# EAGLE design BuzzerBaseShieldv00 (EAGLE 6.6.0)
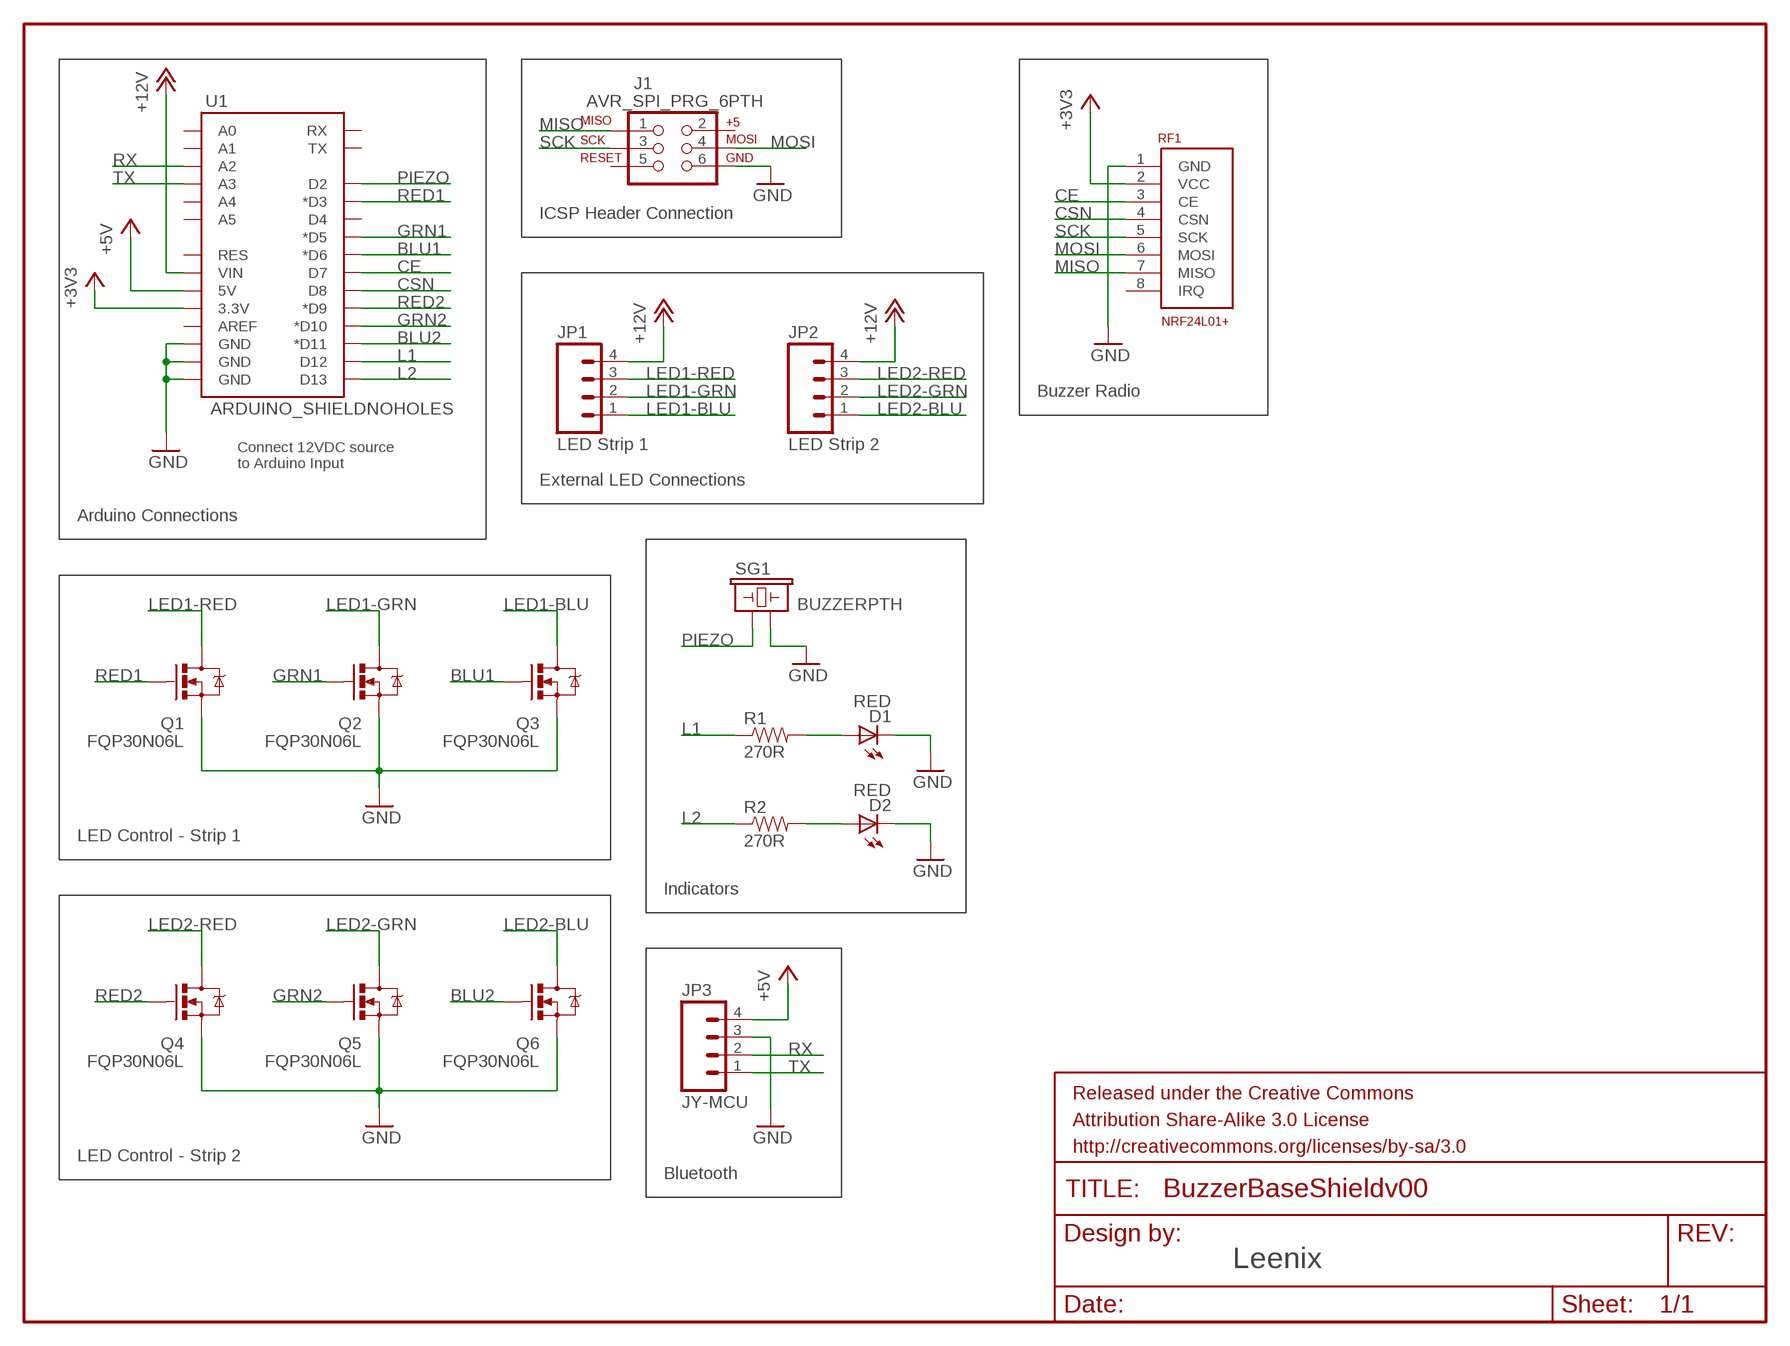
[diagram p0: schematic, sheet 1, part 1 of 2]
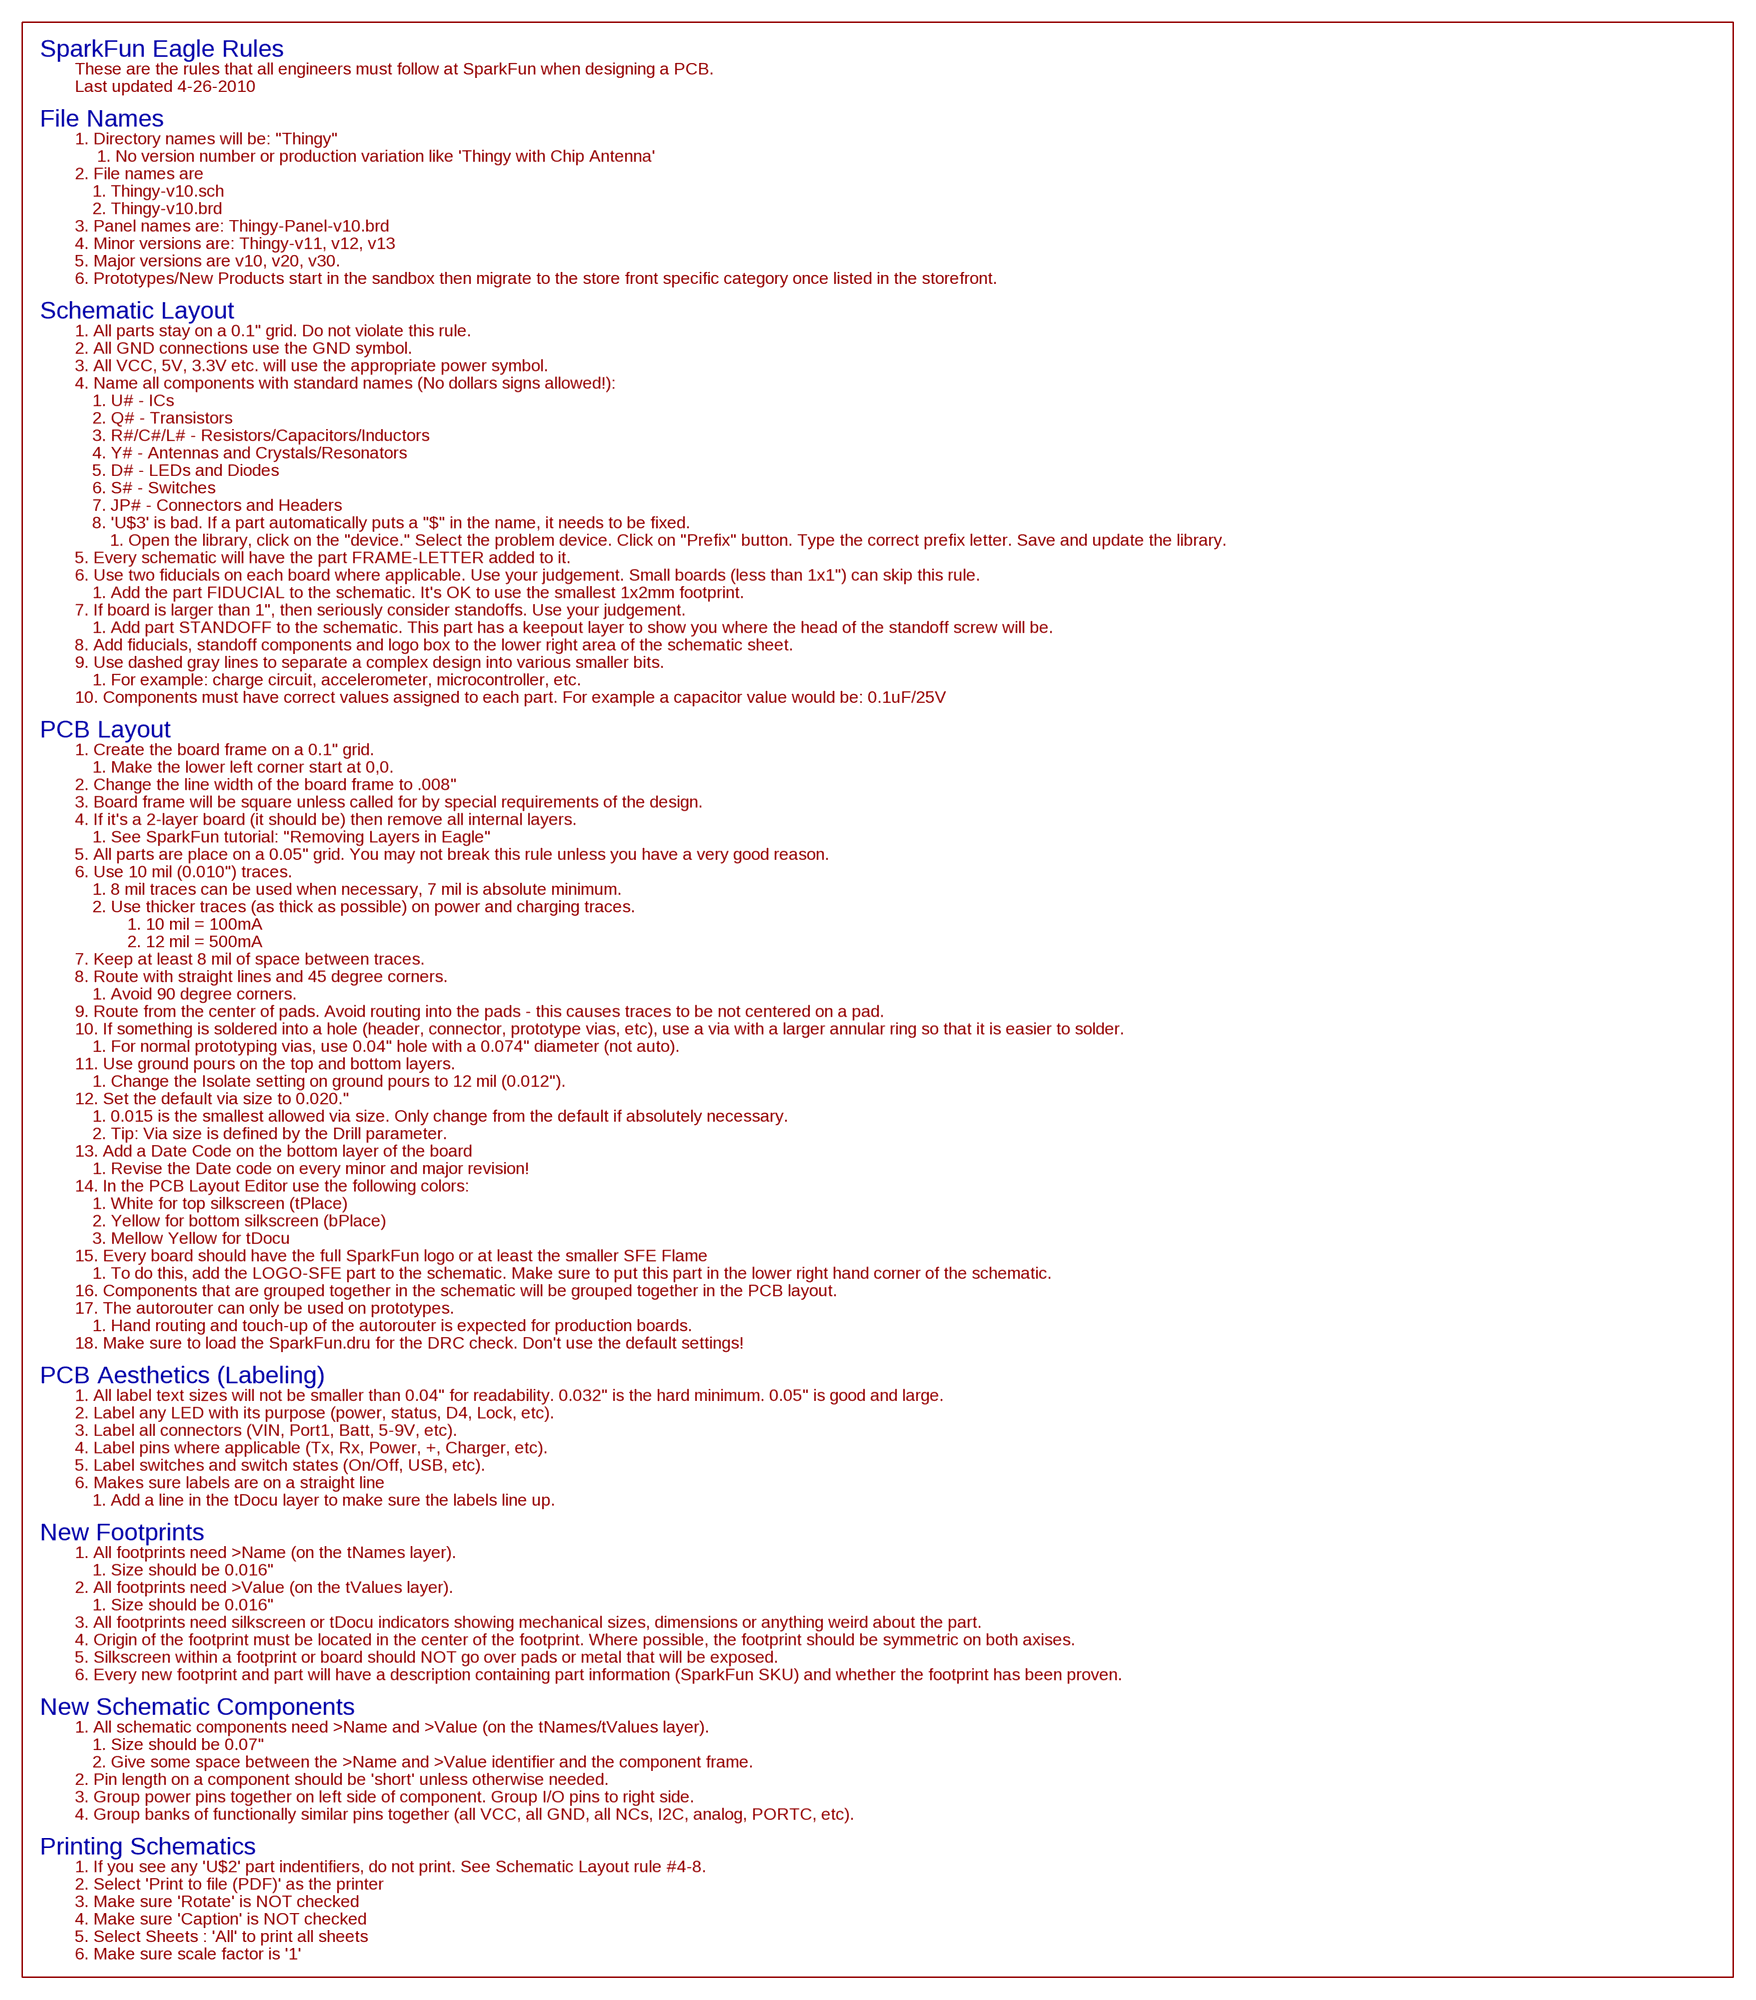
[diagram p1: schematic, sheet 1, part 2 of 2]

## Parts
D1  RED  LED-RED1206  [LED-1206]
D2  RED  LED-RED1206  [LED-1206]
FRAME1  FRAME-LETTER  [CREATIVE_COMMONS]
J1  AVR_SPI_PRG_6PTH  [2X3]
JP1  LED Strip 1  M04LONGPADS  [1X04_LONGPADS]
JP2  LED Strip 2  M04LONGPADS  [1X04_LONGPADS]
JP3  JY-MCU  M04PTH  [1X04]
Q1  FQP30N06L  MOSFET-NCHANNELFQP30N06L  [TO220V]
Q2  FQP30N06L  MOSFET-NCHANNELFQP30N06L  [TO220V]
Q3  FQP30N06L  MOSFET-NCHANNELFQP30N06L  [TO220V]
Q4  FQP30N06L  MOSFET-NCHANNELFQP30N06L  [TO220V]
Q5  FQP30N06L  MOSFET-NCHANNELFQP30N06L  [TO220V]
Q6  FQP30N06L  MOSFET-NCHANNELFQP30N06L  [TO220V]
R1  270R  RESISTOR1206  [1206]
R2  270R  RESISTOR1206  [1206]
RF1  NRF24L01+  [NRF24L01+-HEADER]
SG1  BUZZERPTH  [BUZZER-12MM]
U1  ARDUINO_SHIELDNOHOLES  [DUEMILANOVE_SHIELD_NOHOLES]

## Nets
+3V3: RF1.2(VCC) U1.3.3V
+5V: JP3.4 U1.5V
+12V: JP1.4 JP2.4 U1.VIN
BLU1: Q3.1(G) U1.D6(*D6)
BLU2: Q6.1(G) U1.D11(*D11)
CE: RF1.3(CE) U1.D7
CSN: RF1.4(CSN) U1.D8
GND: D1.C D2.C J1.6 JP3.3 Q1.3(S) Q2.3(S) Q3.3(S) Q4.3(S) Q5.3(S) Q6.3(S) RF1.1(GND) SG1.- U1.GND@0(GND) U1.GND@1(GND) U1.GND@2(GND)
GRN1: Q2.1(G) U1.D5(*D5)
GRN2: Q5.1(G) U1.D10(*D10)
L1: R1.1 U1.D12
L2: R2.1 U1.D13
LED1-BLU: JP1.1 Q3.2(D)
LED1-GRN: JP1.2 Q2.2(D)
LED1-RED: JP1.3 Q1.2(D)
LED2-BLU: JP2.1 Q6.2(D)
LED2-GRN: JP2.2 Q5.2(D)
LED2-RED: JP2.3 Q4.2(D)
MISO: J1.1 RF1.7(MISO)
MOSI: J1.4 RF1.6(MOSI)
N$1: D2.A R2.2
N$2: D1.A R1.2
PIEZO: SG1.+ U1.D2
RED1: Q1.1(G) U1.D3(*D3)
RED2: Q4.1(G) U1.D9(*D9)
RX: JP3.2 U1.A2
SCK: J1.3 RF1.5(SCK)
TX: JP3.1 U1.A3
Unconnected: J1.2 J1.5 RF1.8(IRQ) U1.A0 U1.A1 U1.A4 U1.A5 U1.AREF U1.D4 U1.RES U1.RX U1.TX

## Notes on the sheet
- ICSP Header Connection
- Buzzer Radio
- Connect 12VDC source
  to Arduino Input
- External LED Connections
- Arduino Connections
- LED Control - Strip 1
- Indicators
- LED Control - Strip 2
- Bluetooth
- Leenix

## Library data of the parts
D1 D2 = SparkFun-LED:LED-RED: Assorted Red LEDs LilyPad 1206- DIO-09912 1206- DIO-00809 0603- DIO-00819; PROD_ID: DIO-00809
FRAME1 = SparkFun-Aesthetics:FRAME-LETTER: Schematic Frame Standard 8.5x11 US Letter frame
J1 = SparkFun-Connectors:AVR_SPI_PRG_6: AVR ISP 6 Pin This is the reduced ISP connector for AVR programming. Common on Arduino. This footprint will take up less PCB space and can be used with a 10-pin to 6-pin adapter such as SKU: BOB-08508
JP1-JP3 = SparkFun-Connectors:M04: Header 4 Standard 4-pin 0.1" header. Use with straight break away headers (SKU : PRT-00116), right angle break away headers (PRT-00553), swiss pins (PRT-00743), machine pins (PRT-00117), and female headers (PRT-00115). Molex polarized connector foot print use with SKU : PRT-08231 with associated crimp pins and housings. 1MM SMD Version SKU: PRT-10208
Q1-Q6 = SparkFun-DiscreteSemi:MOSFET-NCHANNEL: Common NMOSFET Parts MFG P/N Store ID Prod ID FDD8780 TRANS-09984 SI7820DN TRANS-11055 FDS6630A IC-08089 2N7002PW TRANS-11151 FQP30N06L COM-10213 TRANS-10060 BSS123LT1G TRANS-08345 BSS138 TRANS-00830 BS170 2N7000; PROD_ID: TRANS-10060
R1 R2 = SparkFun-Resistors:RESISTOR: Resistor Basic schematic elements and footprints for 0603, 1206, and PTH resistors.
RF1 = Leenix:NRF24L01+
SG1 = SparkFun-Electromechanical:BUZZER: Buzzer 12mm Spark Fun Electronics SKU : Comp-Buzzer
U1 = SparkFun-Boards:ARDUINO_SHIELD: Arduino shield footprint

## Board
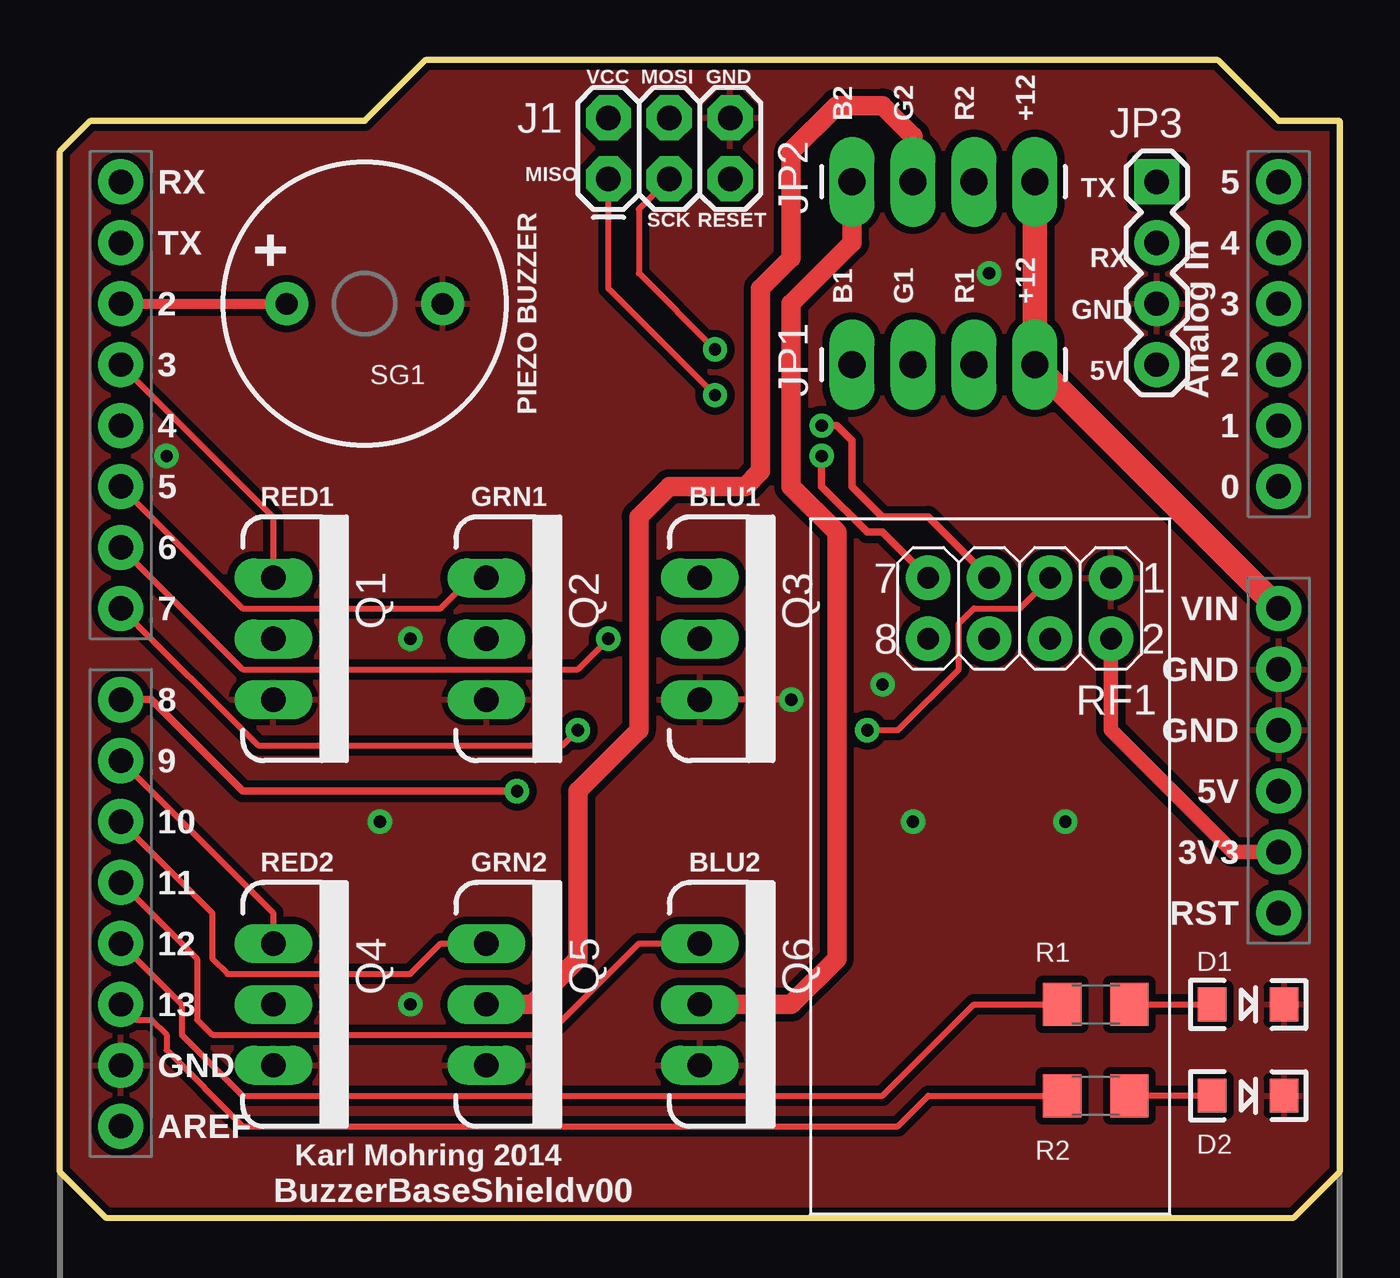
[diagram p2: board, top side]
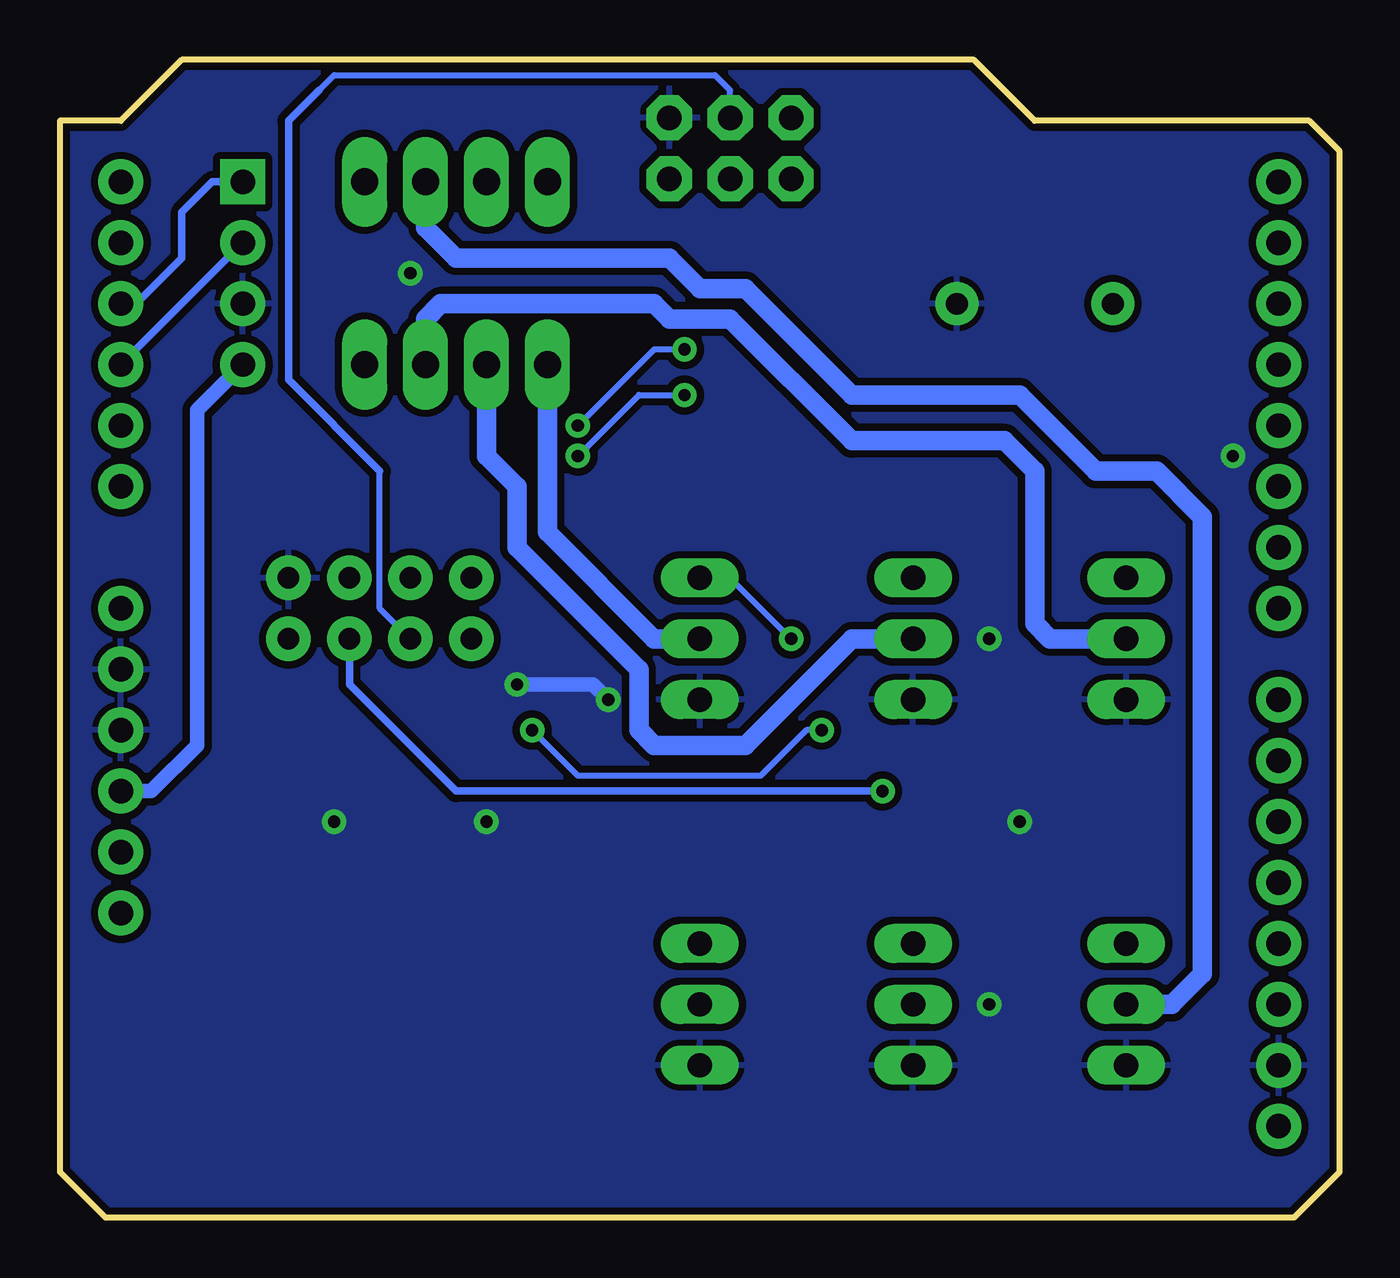
[diagram p3: board, bottom side, seen from below]

Size 53.34 x 48.26 mm. Coordinates in mm from the lower left corner, seen from the top.
Outline: 1.91,0 0,1.91 0,44.45 1.27,45.72 12.7,45.72 15.24,48.26 48.26,48.26 50.8,45.72 53.34,45.72 53.34,1.91 51.44,0 1.91,0
Copper layers (1*16): Top 0.035mm / dielectric 1.5mm / Bottom 0.035mm
Design rules "SparkFun": minimum track width 8mil, minimum drill 20mil, track to track 8mil, track to pad 8mil, pad to pad 8mil, via to via 8mil, smd to smd 8mil, copper to edge 10mil, drill to drill 8mil, minimum pad ring 12mil, minimum via ring 10mil, stop-mask expansion 4mil, vias tented up to drill 25mil, thermal gap 10mil

### Footprints (pad centres in the part's own frame; a part is rotated, then mirrored left to right if it is on the bottom)
LED-1206 = smd 1.2 x 1.4: A -1.5,0; C 1.5,0
2X3 = drill 1.016 pad 1.88 octagon: 1 0,0; 2 0,2.54; 3 2.54,0; 4 2.54,2.54; 5 5.08,0; 6 5.08,2.54
1X04_LONGPADS = drill 1.118 pad 1.88 long: 1 0,0; 2 2.54,0; 3 5.08,0; 4 7.62,0
1X04 = drill 1.016 pad 1.88 square: 1 0,0 | drill 1.016 pad 1.88: 2 2.54,0; 3 5.08,0; 4 7.62,0
TO220V = drill 1.016 long: 1 -2.54,0; 2 0,0; 3 2.54,0
1206 = smd 1.6 x 1.8: 1 -1.4,0; 2 1.4,0
NRF24L01+-HEADER = drill 0.9 pad 1.85: 1 -2.54,-2.54; 2 -2.54,0; 3 0,-2.54; 4 0,0; 5 2.54,-2.54; 6 2.54,0; 7 5.08,-2.54; 8 5.08,0
BUZZER-12MM = drill 0.9 pad 1.778: + 3.25,0; - -3.25,0
DUEMILANOVE_SHIELD_NOHOLES = drill 1.016 pad 1.88: 3.3V 50.8,26.67; 5V 50.8,29.21; A0 50.8,41.91; A1 50.8,44.45; A2 50.8,46.99; A3 50.8,49.53; A4 50.8,52.07; A5 50.8,54.61; AREF 2.54,15.24; D2 2.54,49.53; D3 2.54,46.99; D4 2.54,44.45; D5 2.54,41.91; D6 2.54,39.37; D7 2.54,36.83; D8 2.54,33.02; D9 2.54,30.48; D10 2.54,27.94; D11 2.54,25.4; D12 2.54,22.86; D13 2.54,20.32; GND@0 50.8,31.75; GND@1 50.8,34.29; GND@2 2.54,17.78; RES 50.8,24.13; RX 2.54,54.61; TX 2.54,52.07; VIN 50.8,36.83

### Placement (x,y rotation side)
D1  49.53,8.89 0 top
D2  49.53,5.08 0 top
FRAME1  0,80.01 0 top  (outside the outline)
J1  22.86,43.31 0 top
JP1  33.02,35.56 0 top
JP2  33.02,43.18 0 top
JP3  45.72,43.18 270 top
Q1  8.89,24.13 270 top
Q2  17.78,24.13 270 top
Q3  26.67,24.13 270 top
Q4  8.89,8.89 270 top
Q5  17.78,8.89 270 top
Q6  26.67,8.89 270 top
R1  43.18,8.89 0 top
R2  43.18,5.08 0 top
RF1  41.27,24.13 180 top
SG1  12.7,38.1 180 top
U1  0,-11.43 0 top

### Tracks (layer width: path | path; a pad name or v marks a point on that pad's centre or on a via)
+3V3
  Top 0.61: U1.3.3V 48.9,15.24 43.81,20.32 RF1.2
+5V
  Bottom 0.61: U1.5V 49.53,17.78 47.62,19.68 47.62,33.66 JP3.4
+12V
  Top 1.016: U1.VIN JP1.4 JP2.4
BLU1  (via drill 0.51)
  Top 0.254: U1.D6 7.62,22.86 21.59,22.86 v22.86,24.13
  Bottom 0.254: v22.86,24.13 25.4,26.67 Q3.1
BLU2
  Top 0.254: U1.D11 5.71,10.79 5.71,8.26 6.35,7.62 20.32,7.62 24.13,11.43 Q6.1
CE  (via drill 0.51)
  Top 0.254: U1.D7 8.26,19.68 20.95,19.68 v21.59,20.32 | v33.66,20.32 34.92,20.32 37.47,22.86 37.47,24.77 38.1,25.4 40.01,25.4 RF1.3
  Bottom 0.254: v21.59,20.32 22.23,20.32 24.13,18.41 31.75,18.41 v33.66,20.32
CSN  (via drill 0.51)
  Top 0.305: U1.D8 3.81,21.59 7.62,17.78 v19.05,17.78
  Bottom 0.305: v19.05,17.78 36.83,17.78 41.27,22.23 RF1.4
GND  (via drill 0.51)
  Top 0.254: v30.48,21.59 Q3.3
  Bottom 0.61: v34.29,22.23 31.11,22.23 v30.48,21.59
  other vias: 4.45,31.75 14.61,24.13 13.34,16.51 14.61,8.89 35.56,16.51 41.91,16.51 38.73,39.37
  pour Top (isolate 0.305): 1.27,45.72 0,44.45 0,1.91 1.91,0 51.44,0 53.34,1.91 53.34,45.72 50.8,45.72 48.26,48.26 15.24,48.26 12.7,45.72
  pour Bottom (isolate 0.305): 1.27,45.72 0,44.45 0,1.91 1.91,0 51.44,0 53.34,1.91 53.34,45.72 50.8,45.72 48.26,48.26 15.24,48.26 12.7,45.72
GRN1
  Top 0.254: U1.D5 7.62,25.4 15.88,25.4 17.14,26.67 Q2.1
GRN2
  Top 0.254: U1.D10 6.35,12.7 6.35,10.79 6.99,10.16 14.61,10.16 15.88,11.43 Q5.1
L1
  Top 0.254: U1.D12 5.08,8.89 5.08,7.62 7.62,5.08 34.29,5.08 38.1,8.89 R1.1
L2
  Top 0.254: U1.D13 3.17,8.26 3.81,8.26 4.45,7.62 4.45,6.99 7.62,3.81 34.92,3.81 36.2,5.08 R2.1
LED1-BLU
  Bottom 0.813: Q3.2 28.57,24.13 33.02,28.57 JP1.1
LED1-GRN
  Bottom 0.813: Q2.2 20.32,24.13 24.77,19.68 28.57,19.68 29.21,20.32 29.21,22.86 34.29,27.94 34.29,30.48 35.56,31.75 JP1.2
LED1-RED
  Bottom 0.813: Q1.2 12.06,24.13 12.7,24.77 12.7,31.11 13.97,32.38 20.32,32.38 25.4,37.47 27.94,37.47 28.57,38.1 37.47,38.1 38.1,37.47 JP1.3
LED2-BLU
  Top 0.813: Q6.2 30.48,8.89 32.38,10.79 32.38,28.57 30.48,30.48 30.48,38.1 33.02,40.64 JP2.1
LED2-GRN
  Top 0.813: Q5.2 19.68,8.89 21.59,10.79 21.59,17.78 24.13,20.32 24.13,29.21 25.4,30.48 28.57,30.48 29.21,31.11 29.21,38.73 30.48,40.01 30.48,44.45 32.38,46.35 34.29,46.35 35.56,45.09 JP2.2
LED2-RED
  Bottom 0.813: JP2.3 38.1,41.27 36.83,40.01 27.94,40.01 26.67,38.73 24.77,38.73 20.32,34.29 13.34,34.29 10.16,31.11 7.62,31.11 5.71,29.21 5.71,10.16 6.99,8.89 Q4.2
MISO  (via drill 0.51)
  Top 0.254: v27.3,34.29 22.86,38.73 J1.1
  Top 0.305: v31.75,31.75 31.75,30.48 33.66,28.57 34.29,28.57 RF1.7
  Bottom 0.254: v31.75,31.75 29.21,34.29 v27.3,34.29
MOSI
  Bottom 0.254: J1.4 25.4,46.99 26.04,47.62 41.91,47.62 42.55,46.99 | RF1.6 40.01,25.4 40.01,31.11
  Bottom 0.305: 40.01,31.11 43.81,34.92 43.81,45.72 42.55,46.99
N$1
  Top 0.254: D2.A R2.2
N$2
  Top 0.254: R1.2 D1.A
PIEZO
  Top 0.406: U1.D2 SG1.+
RED1
  Top 0.254: U1.D3 8.89,29.21 Q1.1
RED2
  Top 0.254: U1.D9 8.89,12.7 Q4.1
RX
  Bottom 0.305: U1.A2 JP3.2
SCK  (via drill 0.51)
  Top 0.254: J1.3 24.13,42.04 24.13,39.37 v27.3,36.2
  Top 0.305: v31.75,33.02 32.38,33.02 33.02,32.38 33.02,30.48 34.29,29.21 36.2,29.21 RF1.5
  Bottom 0.254: v27.3,36.2 28.57,36.2 v31.75,33.02
TX
  Bottom 0.305: U1.A3 50.16,38.1 48.26,40.01 48.26,41.91 46.99,43.18 JP3.1

### Text on the board
tPlace: VCC | MOSI | GND | B2 | G2 | R2 | +12 | MISO | TX | PIEZO BUZZER | SCK | RESET | + | RX | B1 | G1 | R1 | +12 | GND | 5V | RED1 | GRN1 | BLU1 | RED2 | GRN2 | BLU2 | Karl Mohring 2014